# EAGLE schematic das48 (EAGLE 9.6.2)
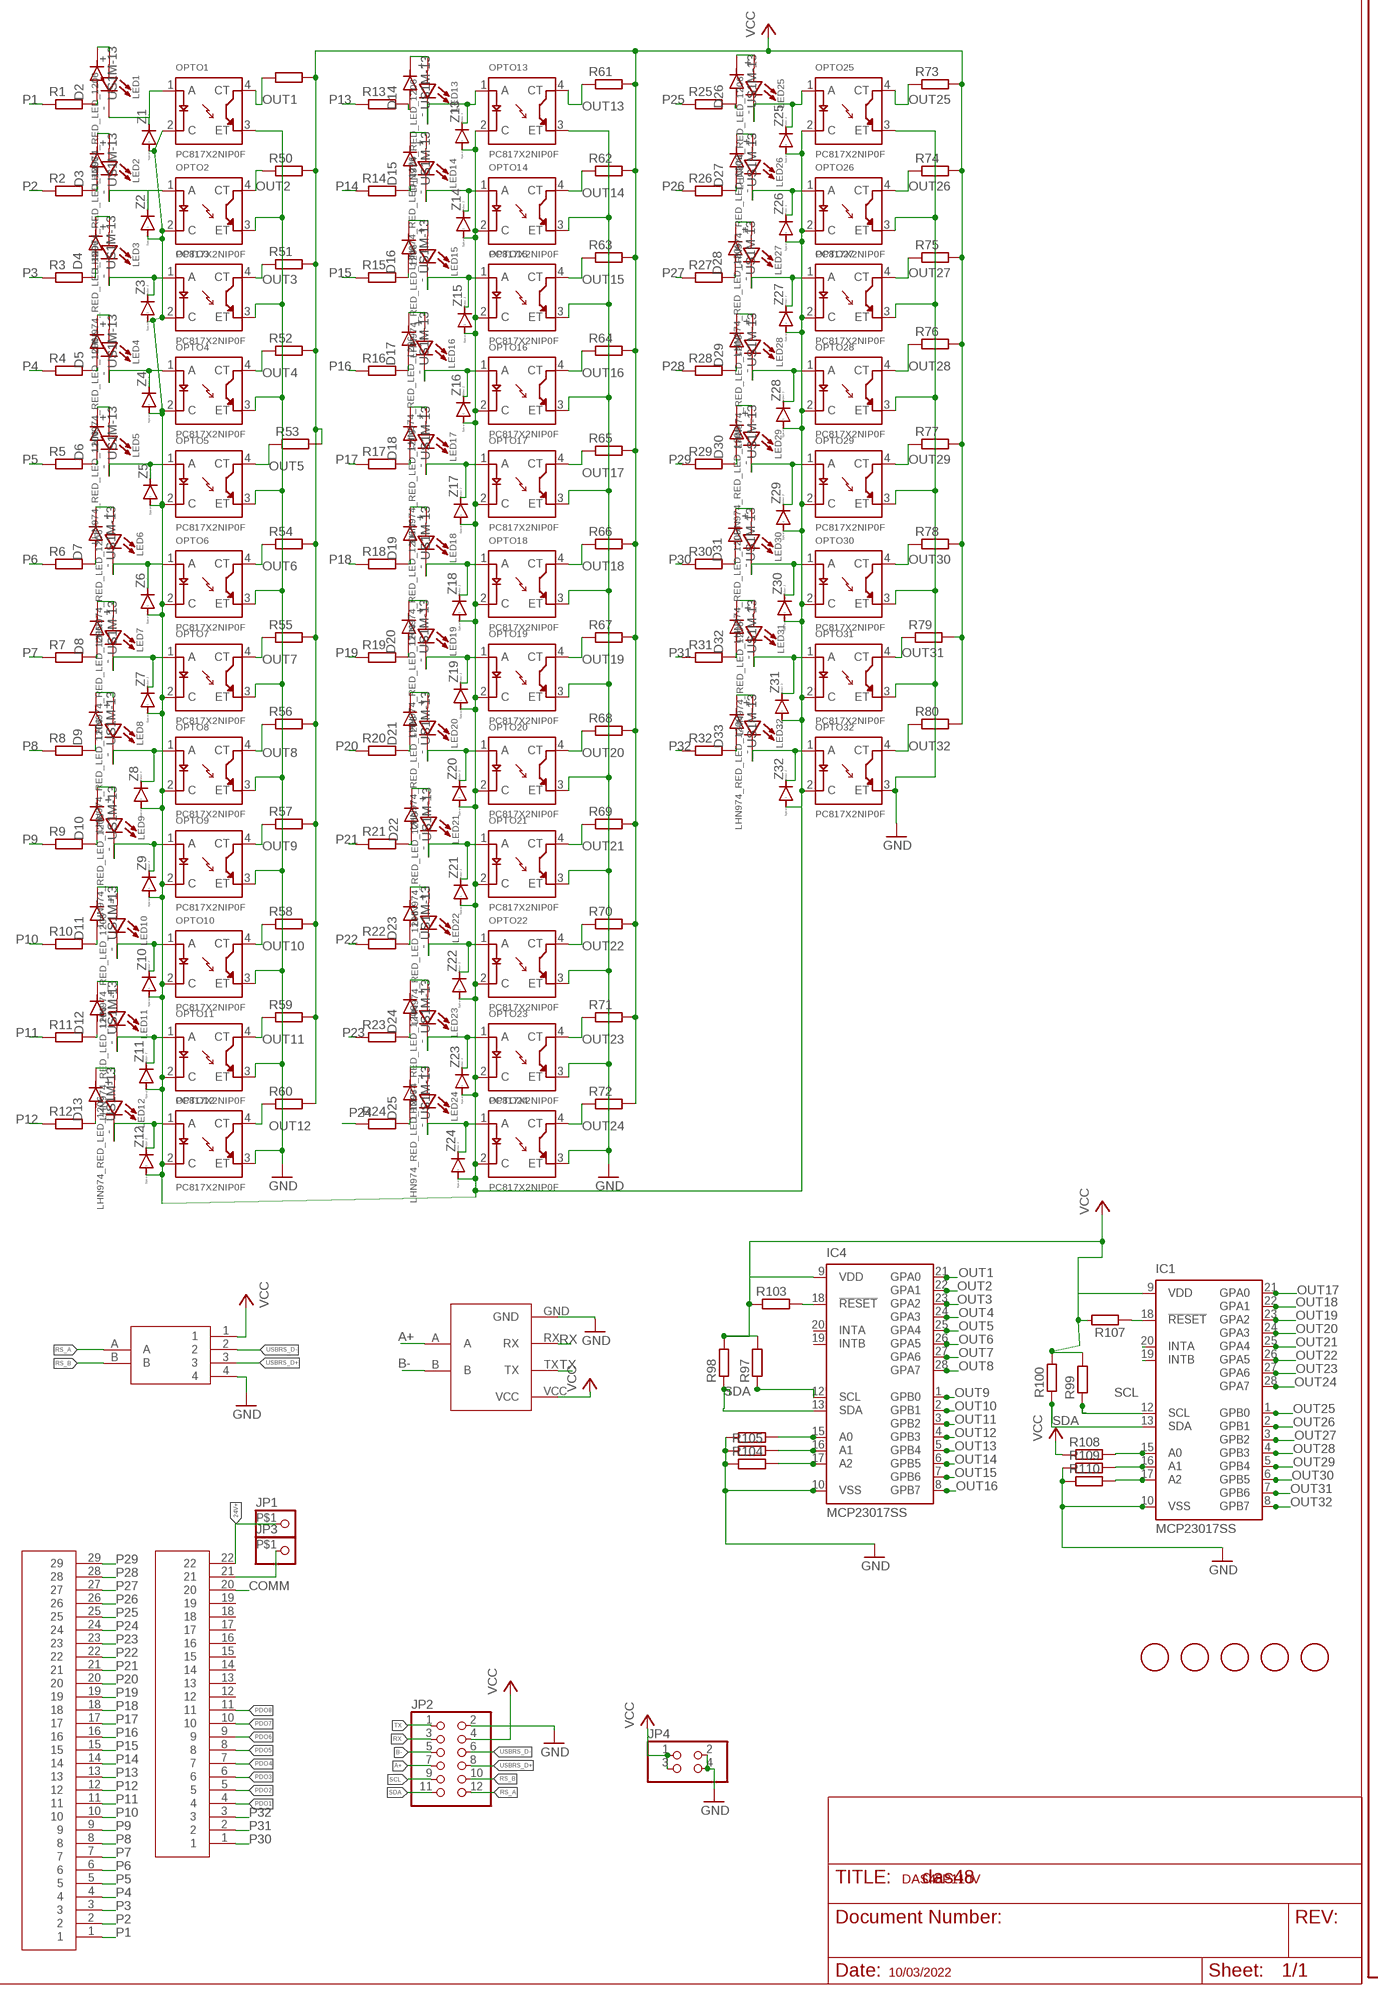
[diagram p0: schematic, sheet 1, part 1 of 2]
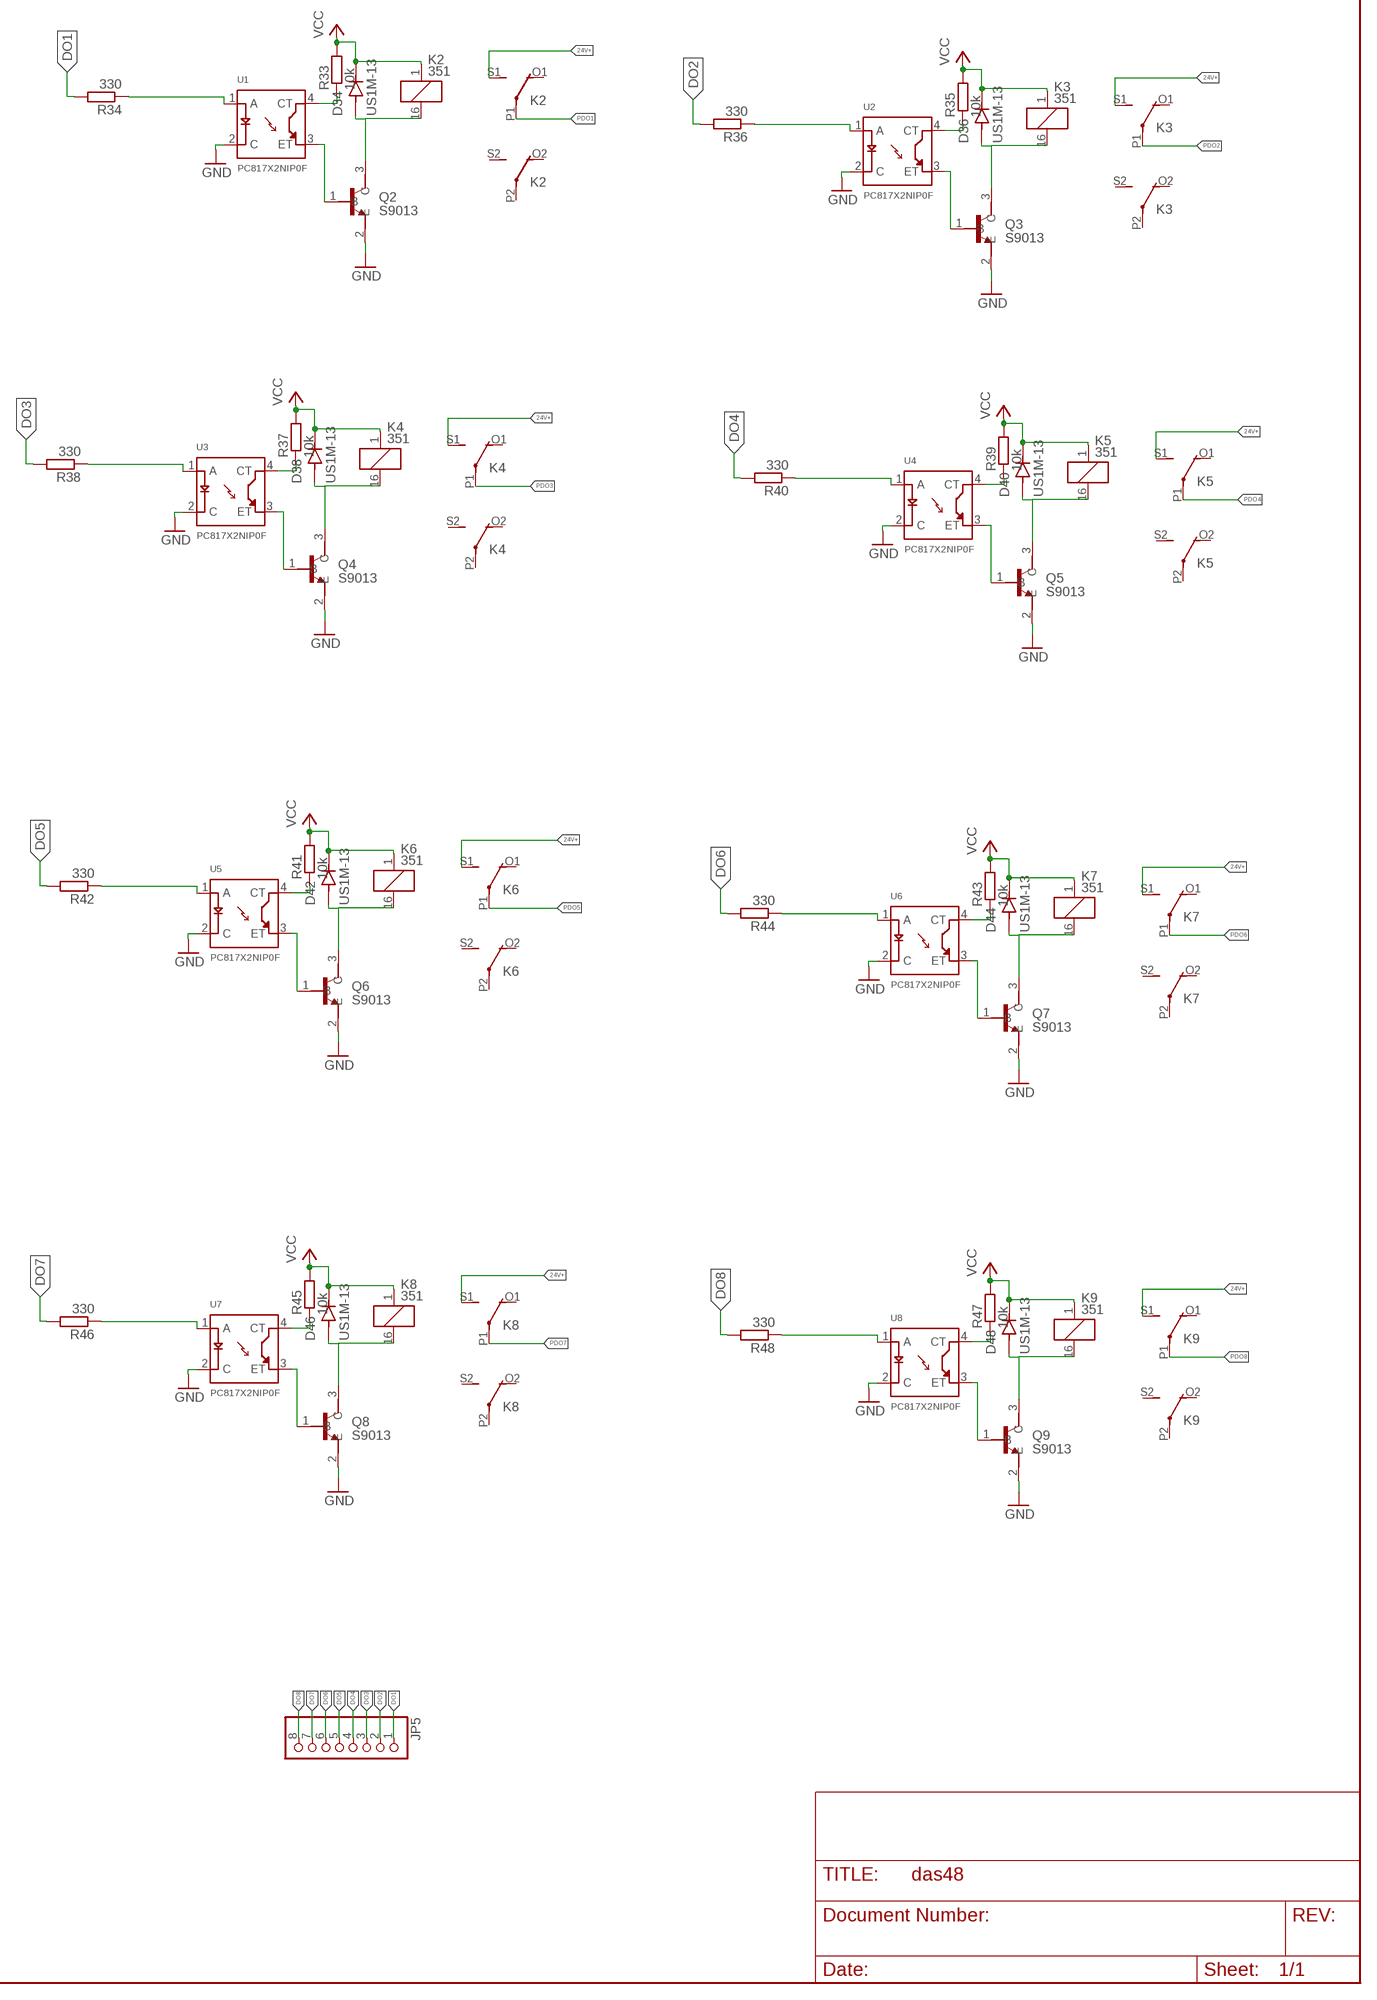
[diagram p1: schematic, sheet 1, part 2 of 2]

## Parts
D2  US1M-13  [DIOM5226X240N]
D3  US1M-13  [DIOM5226X240N]
D4  US1M-13  [DIOM5226X240N]
D5  US1M-13  [DIOM5226X240N]
D6  US1M-13  [DIOM5226X240N]
D7  US1M-13  [DIOM5226X240N]
D8  US1M-13  [DIOM5226X240N]
D9  US1M-13  [DIOM5226X240N]
D10  US1M-13  [DIOM5226X240N]
D11  US1M-13  [DIOM5226X240N]
D12  US1M-13  [DIOM5226X240N]
D13  US1M-13  [DIOM5226X240N]
D14  US1M-13  [DIOM5226X240N]
D15  US1M-13  [DIOM5226X240N]
D16  US1M-13  [DIOM5226X240N]
D17  US1M-13  [DIOM5226X240N]
D18  US1M-13  [DIOM5226X240N]
D19  US1M-13  [DIOM5226X240N]
D20  US1M-13  [DIOM5226X240N]
D21  US1M-13  [DIOM5226X240N]
D22  US1M-13  [DIOM5226X240N]
D23  US1M-13  [DIOM5226X240N]
D24  US1M-13  [DIOM5226X240N]
D25  US1M-13  [DIOM5226X240N]
D26  US1M-13  [DIOM5226X240N]
D27  US1M-13  [DIOM5226X240N]
D28  US1M-13  [DIOM5226X240N]
D29  US1M-13  [DIOM5226X240N]
D30  US1M-13  [DIOM5226X240N]
D31  US1M-13  [DIOM5226X240N]
D32  US1M-13  [DIOM5226X240N]
D33  US1M-13  [DIOM5226X240N]
D34  US1M-13  [DIOM5226X240N]
D36  US1M-13  [DIOM5226X240N]
D38  US1M-13  [DIOM5226X240N]
D40  US1M-13  [DIOM5226X240N]
D42  US1M-13  [DIOM5226X240N]
D44  US1M-13  [DIOM5226X240N]
D46  US1M-13  [DIOM5226X240N]
D48  US1M-13  [DIOM5226X240N]
HEADER-22P1  HEADER-22P  [HEADER-29P]
HEADER-29P1  HEADER-29P  [HEADER-29P]
IC1  MCP23017SS  [SSOP28DB]
IC4  MCP23017SS  [SSOP28DB]
JP1  PINHD-1X1-BIGPOGO  [1X1-BIGPOGO]
JP2  PINHD-2X6  [2X06]
JP3  PINHD-1X1-BIGPOGO  [1X1-BIGPOGO]
JP4  PINHD-2X2  [2X02]
JP5  PINHD-1X8  [1X08]
K2  351  [351]
K3  351  [351]
K4  351  [351]
K5  351  [351]
K6  351  [351]
K7  351  [351]
K8  351  [351]
K9  351  [351]
LED1  LHN974_RED_LED_1206  [LEDC3216X120N]
LED2  LHN974_RED_LED_1206  [LEDC3216X120N]
LED3  LHN974_RED_LED_1206  [LEDC3216X120N]
LED4  LHN974_RED_LED_1206  [LEDC3216X120N]
LED5  LHN974_RED_LED_1206  [LEDC3216X120N]
LED6  LHN974_RED_LED_1206  [LEDC3216X120N]
LED7  LHN974_RED_LED_1206  [LEDC3216X120N]
LED8  LHN974_RED_LED_1206  [LEDC3216X120N]
LED9  LHN974_RED_LED_1206  [LEDC3216X120N]
LED10  LHN974_RED_LED_1206  [LEDC3216X120N]
LED11  LHN974_RED_LED_1206  [LEDC3216X120N]
LED12  LHN974_RED_LED_1206  [LEDC3216X120N]
LED13  LHN974_RED_LED_1206  [LEDC3216X120N]
LED14  LHN974_RED_LED_1206  [LEDC3216X120N]
LED15  LHN974_RED_LED_1206  [LEDC3216X120N]
LED16  LHN974_RED_LED_1206  [LEDC3216X120N]
LED17  LHN974_RED_LED_1206  [LEDC3216X120N]
LED18  LHN974_RED_LED_1206  [LEDC3216X120N]
LED19  LHN974_RED_LED_1206  [LEDC3216X120N]
LED20  LHN974_RED_LED_1206  [LEDC3216X120N]
LED21  LHN974_RED_LED_1206  [LEDC3216X120N]
LED22  LHN974_RED_LED_1206  [LEDC3216X120N]
LED23  LHN974_RED_LED_1206  [LEDC3216X120N]
LED24  LHN974_RED_LED_1206  [LEDC3216X120N]
LED25  LHN974_RED_LED_1206  [LEDC3216X120N]
LED26  LHN974_RED_LED_1206  [LEDC3216X120N]
LED27  LHN974_RED_LED_1206  [LEDC3216X120N]
LED28  LHN974_RED_LED_1206  [LEDC3216X120N]
LED29  LHN974_RED_LED_1206  [LEDC3216X120N]
LED30  LHN974_RED_LED_1206  [LEDC3216X120N]
LED31  LHN974_RED_LED_1206  [LEDC3216X120N]
LED32  LHN974_RED_LED_1206  [LEDC3216X120N]
OPTO1  PC817X2NIP0F  [SOT254P975X400-4N]
OPTO2  PC817X2NIP0F  [SOT254P975X400-4N]
OPTO3  PC817X2NIP0F  [SOT254P975X400-4N]
OPTO4  PC817X2NIP0F  [SOT254P975X400-4N]
OPTO5  PC817X2NIP0F  [SOT254P975X400-4N]
OPTO6  PC817X2NIP0F  [SOT254P975X400-4N]
OPTO7  PC817X2NIP0F  [SOT254P975X400-4N]
OPTO8  PC817X2NIP0F  [SOT254P975X400-4N]
OPTO9  PC817X2NIP0F  [SOT254P975X400-4N]
OPTO10  PC817X2NIP0F  [SOT254P975X400-4N]
OPTO11  PC817X2NIP0F  [SOT254P975X400-4N]
OPTO12  PC817X2NIP0F  [SOT254P975X400-4N]
OPTO13  PC817X2NIP0F  [SOT254P975X400-4N]
OPTO14  PC817X2NIP0F  [SOT254P975X400-4N]
OPTO15  PC817X2NIP0F  [SOT254P975X400-4N]
OPTO16  PC817X2NIP0F  [SOT254P975X400-4N]
OPTO17  PC817X2NIP0F  [SOT254P975X400-4N]
OPTO18  PC817X2NIP0F  [SOT254P975X400-4N]
OPTO19  PC817X2NIP0F  [SOT254P975X400-4N]
OPTO20  PC817X2NIP0F  [SOT254P975X400-4N]
OPTO21  PC817X2NIP0F  [SOT254P975X400-4N]
OPTO22  PC817X2NIP0F  [SOT254P975X400-4N]
OPTO23  PC817X2NIP0F  [SOT254P975X400-4N]
OPTO24  PC817X2NIP0F  [SOT254P975X400-4N]
OPTO25  PC817X2NIP0F  [SOT254P975X400-4N]
OPTO26  PC817X2NIP0F  [SOT254P975X400-4N]
OPTO27  PC817X2NIP0F  [SOT254P975X400-4N]
OPTO28  PC817X2NIP0F  [SOT254P975X400-4N]
OPTO29  PC817X2NIP0F  [SOT254P975X400-4N]
OPTO30  PC817X2NIP0F  [SOT254P975X400-4N]
OPTO31  PC817X2NIP0F  [SOT254P975X400-4N]
OPTO32  PC817X2NIP0F  [SOT254P975X400-4N]
Q2  S9013  [SOT95P240X120-3N]
Q3  S9013  [SOT95P240X120-3N]
Q4  S9013  [SOT95P240X120-3N]
Q5  S9013  [SOT95P240X120-3N]
Q6  S9013  [SOT95P240X120-3N]
Q7  S9013  [SOT95P240X120-3N]
Q8  S9013  [SOT95P240X120-3N]
Q9  S9013  [SOT95P240X120-3N]
R1  R-EU_0617/17  [0617/17]
R2  R-EU_0617/17  [0617/17]
R3  R-EU_0617/17  [0617/17]
R4  R-EU_0617/17  [0617/17]
R5  R-EU_0617/17  [0617/17]
R6  R-EU_0617/17  [0617/17]
R7  R-EU_0617/17  [0617/17]
R8  R-EU_0617/17  [0617/17]
R9  R-EU_0617/17  [0617/17]
R10  R-EU_0617/17  [0617/17]
R11  R-EU_0617/17  [0617/17]
R12  R-EU_0617/17  [0617/17]
R13  R-EU_0617/17  [0617/17]
R14  R-EU_0617/17  [0617/17]
R15  R-EU_0617/17  [0617/17]
R16  R-EU_0617/17  [0617/17]
R17  R-EU_0617/17  [0617/17]
R18  R-EU_0617/17  [0617/17]
R19  R-EU_0617/17  [0617/17]
R20  R-EU_0617/17  [0617/17]
R21  R-EU_0617/17  [0617/17]
R22  R-EU_0617/17  [0617/17]
R23  R-EU_0617/17  [0617/17]
R24  R-EU_0617/17  [0617/17]
R25  R-EU_0617/17  [0617/17]
R26  R-EU_0617/17  [0617/17]
R27  R-EU_0617/17  [0617/17]
R28  R-EU_0617/17  [0617/17]
R29  R-EU_0617/17  [0617/17]
R30  R-EU_0617/17  [0617/17]
R31  R-EU_0617/17  [0617/17]
R32  R-EU_0617/17  [0617/17]
R33  10k  R-EU_R0805  [R0805]
R34  330  R-EU_R0805  [R0805]
R35  10k  R-EU_R0805  [R0805]
R36  330  R-EU_R0805  [R0805]
R37  10k  R-EU_R0805  [R0805]
R38  330  R-EU_R0805  [R0805]
R39  10k  R-EU_R0805  [R0805]
R40  330  R-EU_R0805  [R0805]
R41  10k  R-EU_R0805  [R0805]
R42  330  R-EU_R0805  [R0805]
R43  10k  R-EU_R0805  [R0805]
R44  330  R-EU_R0805  [R0805]
R45  10k  R-EU_R0805  [R0805]
R46  330  R-EU_R0805  [R0805]
R47  10k  R-EU_R0805  [R0805]
R48  330  R-EU_R0805  [R0805]
R49  R-EU_R0805  [R0805]
R50  R-EU_R0805  [R0805]
R51  R-EU_R0805  [R0805]
R52  R-EU_R0805  [R0805]
R53  R-EU_R0805  [R0805]
R54  R-EU_R0805  [R0805]
R55  R-EU_R0805  [R0805]
R56  R-EU_R0805  [R0805]
R57  R-EU_R0805  [R0805]
R58  R-EU_R0805  [R0805]
R59  R-EU_R0805  [R0805]
R60  R-EU_R0805  [R0805]
R61  R-EU_R0805  [R0805]
R62  R-EU_R0805  [R0805]
R63  R-EU_R0805  [R0805]
R64  R-EU_R0805  [R0805]
R65  R-EU_R0805  [R0805]
R66  R-EU_R0805  [R0805]
R67  R-EU_R0805  [R0805]
R68  R-EU_R0805  [R0805]
R69  R-EU_R0805  [R0805]
R70  R-EU_R0805  [R0805]
R71  R-EU_R0805  [R0805]
R72  R-EU_R0805  [R0805]
R73  R-EU_R0805  [R0805]
R74  R-EU_R0805  [R0805]
R75  R-EU_R0805  [R0805]
R76  R-EU_R0805  [R0805]
R77  R-EU_R0805  [R0805]
R78  R-EU_R0805  [R0805]
R79  R-EU_R0805  [R0805]
R80  R-EU_R0805  [R0805]
R97  R-EU_R0805  [R0805]
R98  R-EU_R0805  [R0805]
R99  R-EU_R0805  [R0805]
R100  R-EU_R0805  [R0805]
R103  R-EU_R0805  [R0805]
R104  R-EU_R0805  [R0805]
R105  R-EU_R0805  [R0805]
R106  R-EU_R0805  [R0805]
R107  R-EU_R0805  [R0805]
R108  R-EU_R0805  [R0805]
R109  R-EU_R0805  [R0805]
R110  R-EU_R0805  [R0805]
TTL-RS1  TTL-RS485  [TTL-RS485]
U1  PC817X2NIP0F  [SOT254P975X400-4N]
U2  PC817X2NIP0F  [SOT254P975X400-4N]
U3  PC817X2NIP0F  [SOT254P975X400-4N]
U4  PC817X2NIP0F  [SOT254P975X400-4N]
U5  PC817X2NIP0F  [SOT254P975X400-4N]
U6  PC817X2NIP0F  [SOT254P975X400-4N]
U7  PC817X2NIP0F  [SOT254P975X400-4N]
U8  PC817X2NIP0F  [SOT254P975X400-4N]
U$1  FIDUCIAL  [FIDUCIAL_1MM]
U$2  FIDUCIAL  [FIDUCIAL_1MM]
U$3  FIDUCIAL  [FIDUCIAL_1MM]
U$4  FIDUCIAL  [FIDUCIAL_1MM]
U$5  FIDUCIAL  [FIDUCIAL_1MM]
USB2RS1  USB2RS485  [USB2RS485]
Z1  DIODE-SOD123  [SOD123]
Z2  DIODE-SOD123  [SOD123]
Z3  DIODE-SOD123  [SOD123]
Z4  DIODE-SOD123  [SOD123]
Z5  DIODE-SOD123  [SOD123]
Z6  DIODE-SOD123  [SOD123]
Z7  DIODE-SOD123  [SOD123]
Z8  DIODE-SOD123  [SOD123]
Z9  DIODE-SOD123  [SOD123]
Z10  DIODE-SOD123  [SOD123]
Z11  DIODE-SOD123  [SOD123]
Z12  DIODE-SOD123  [SOD123]
Z13  DIODE-SOD123  [SOD123]
Z14  DIODE-SOD123  [SOD123]
Z15  DIODE-SOD123  [SOD123]
Z16  DIODE-SOD123  [SOD123]
Z17  DIODE-SOD123  [SOD123]
Z18  DIODE-SOD123  [SOD123]
Z19  DIODE-SOD123  [SOD123]
Z20  DIODE-SOD123  [SOD123]
Z21  DIODE-SOD123  [SOD123]
Z22  DIODE-SOD123  [SOD123]
Z23  DIODE-SOD123  [SOD123]
Z24  DIODE-SOD123  [SOD123]
Z25  DIODE-SOD123  [SOD123]
Z26  DIODE-SOD123  [SOD123]
Z27  DIODE-SOD123  [SOD123]
Z28  DIODE-SOD123  [SOD123]
Z29  DIODE-SOD123  [SOD123]
Z30  DIODE-SOD123  [SOD123]
Z31  DIODE-SOD123  [SOD123]
Z32  DIODE-SOD123  [SOD123]

## Nets
24V+: HEADER-22P1.22 JP1.P$1 K2.S1(2:S) K3.S1(2:S) K4.S1(2:S) K5.S1(2:S) K6.S1(2:S) K7.S1(2:S) K8.S1(2:S) K9.S1(2:S)
A+: JP2.7 TTL-RS1.A
B-: JP2.5 TTL-RS1.B
COMM: HEADER-22P1.20 OPTO1.2(C) OPTO2.2(C) OPTO3.2(C) OPTO4.2(C) OPTO5.2(C) OPTO6.2(C) OPTO7.2(C) OPTO8.2(C) OPTO9.2(C) OPTO10.2(C) OPTO11.2(C) OPTO12.2(C) OPTO13.2(C) OPTO14.2(C) OPTO15.2(C) OPTO16.2(C) OPTO17.2(C) OPTO18.2(C) OPTO19.2(C) OPTO20.2(C) OPTO21.2(C) OPTO22.2(C) OPTO23.2(C) OPTO24.2(C) OPTO25.2(C) OPTO26.2(C) OPTO27.2(C) OPTO28.2(C) OPTO29.2(C) OPTO30.2(C) OPTO31.2(C) OPTO32.2(C) Z1.A Z2.A Z3.A Z4.A Z5.A Z6.A Z7.A Z8.A Z9.A Z10.A Z11.A Z12.A Z13.A Z14.A Z15.A Z16.A Z17.A Z18.A Z19.A Z20.A Z21.A Z22.A Z23.A Z24.A Z25.A Z26.A Z27.A Z28.A Z29.A Z30.A Z31.A Z32.A
DO1: JP5.1 R34.2
DO2: JP5.2 R36.2
DO3: JP5.3 R38.2
DO4: JP5.4 R40.2
DO5: JP5.5 R42.2
DO6: JP5.6 R44.2
DO7: JP5.7 R46.2
DO8: JP5.8 R48.2
GND: IC1.10(VSS) IC4.10(VSS) JP2.2 JP4.2 JP4.4 OPTO1.3(ET) OPTO2.3(ET) OPTO3.3(ET) OPTO4.3(ET) OPTO5.3(ET) OPTO6.3(ET) OPTO7.3(ET) OPTO8.3(ET) OPTO9.3(ET) OPTO10.3(ET) OPTO11.3(ET) OPTO12.3(ET) OPTO13.3(ET) OPTO14.3(ET) OPTO15.3(ET) OPTO16.3(ET) OPTO17.3(ET) OPTO18.3(ET) OPTO19.3(ET) OPTO20.3(ET) OPTO21.3(ET) OPTO22.3(ET) OPTO23.3(ET) OPTO24.3(ET) OPTO25.3(ET) OPTO26.3(ET) OPTO27.3(ET) OPTO28.3(ET) OPTO29.3(ET) OPTO30.3(ET) OPTO31.3(ET) OPTO32.3(ET) Q2.2(E) Q3.2(E) Q4.2(E) Q5.2(E) Q6.2(E) Q7.2(E) Q8.2(E) Q9.2(E) R104.1 R105.1 R106.1 R109.1 R110.1 TTL-RS1.GND U1.2(C) U2.2(C) U3.2(C) U4.2(C) U5.2(C) U6.2(C) U7.2(C) U8.2(C) USB2RS1.4
N$1: D2.A R1.2
N$2: D2.C(K) LED1.+
N$3: D3.A R2.2
N$4: D3.C(K) LED2.+
N$5: D4.A R3.2
N$6: D4.C(K) LED3.+
N$7: D5.A R4.2
N$8: D5.C(K) LED4.+
N$9: D6.A R5.2
N$10: D6.C(K) LED5.+
N$11: D7.A R6.2
N$12: D7.C(K) LED6.+
N$13: D8.A R7.2
N$14: D8.C(K) LED7.+
N$15: D9.A R8.2
N$16: D9.C(K) LED8.+
N$17: D15.A R14.2
N$18: LED1.- OPTO1.1(A) Z1.C
N$19: LED13.- OPTO13.1(A) Z13.C
N$20: D10.A R9.2
N$21: LED14.- OPTO14.1(A) Z14.C
N$22: D10.C(K) LED9.+
N$23: LED15.- OPTO15.1(A) Z15.C
N$24: D11.A R10.2
N$25: LED16.- OPTO16.1(A) Z16.C
N$26: D11.C(K) LED10.+
N$27: LED17.- OPTO17.1(A) Z17.C
N$28: D12.A R11.2
N$29: LED18.- OPTO18.1(A) Z18.C
N$30: D12.C(K) LED11.+
N$31: LED19.- OPTO19.1(A) Z19.C
N$32: LED20.- OPTO20.1(A) Z20.C
N$33: LED21.- OPTO21.1(A) Z21.C
N$34: D15.C(K) LED14.+
N$35: LED22.- OPTO22.1(A) Z22.C
N$36: D13.A R12.2
N$37: LED23.- OPTO23.1(A) Z23.C
N$38: D13.C(K) LED12.+
N$39: LED24.- OPTO24.1(A) Z24.C
N$40: D14.A R13.2
N$41: LED25.- OPTO25.1(A) Z25.C
N$42: D14.C(K) LED13.+
N$43: LED26.- OPTO26.1(A) Z26.C
N$44: D16.A R15.2
N$45: LED27.- OPTO27.1(A) Z27.C
N$46: D16.C(K) LED15.+
N$47: LED28.- OPTO28.1(A) Z28.C
N$48: D17.A R16.2
N$49: LED29.- OPTO29.1(A) Z29.C
N$50: D17.C(K) LED16.+
N$51: LED30.- OPTO30.1(A) Z30.C
N$52: D18.A R17.2
N$53: LED31.- OPTO31.1(A) Z31.C
N$54: D18.C(K) LED17.+
N$55: LED32.- OPTO32.1(A) Z32.C
N$56: D19.A R18.2
N$57: R34.1 U1.1(A)
N$58: D19.C(K) LED18.+
N$59: D34.A K2.16 Q2.3(C)
N$60: D20.A R19.2
N$61: R36.1 U2.1(A)
N$62: D20.C(K) LED19.+
N$63: R33.1 U1.4(CT)
N$64: D32.A R31.2
N$65: Q2.1(B) U1.3(ET)
N$66: D21.A R20.2
N$67: R38.1 U3.1(A)
N$68: D21.C(K) LED20.+
N$69: D36.A K3.16 Q3.3(C)
N$70: R40.1 U4.1(A)
N$71: D22.A R21.2
N$72: R35.1 U2.4(CT)
N$73: D22.C(K) LED21.+
N$74: Q3.1(B) U2.3(ET)
N$75: R42.1 U5.1(A)
N$76: D23.A R22.2
N$77: D38.A K4.16 Q4.3(C)
N$78: D23.C(K) LED22.+
N$79: R44.1 U6.1(A)
N$80: D24.A R23.2
N$81: R37.1 U3.4(CT)
N$82: D24.C(K) LED23.+
N$83: Q4.1(B) U3.3(ET)
N$84: D25.A R24.2
N$85: R46.1 U7.1(A)
N$86: LED2.- OPTO2.1(A) Z2.C
N$87: LED3.- OPTO3.1(A) Z3.C
N$88: LED4.- OPTO4.1(A) Z4.C
N$89: LED5.- OPTO5.1(A) Z5.C
N$90: LED6.- OPTO6.1(A) Z6.C
N$91: LED7.- OPTO7.1(A) Z7.C
N$92: LED8.- OPTO8.1(A) Z8.C
N$93: LED9.- OPTO9.1(A) Z9.C
N$94: LED10.- OPTO10.1(A) Z10.C
N$95: LED11.- OPTO11.1(A) Z11.C
N$96: LED12.- OPTO12.1(A) Z12.C
N$100: D40.A K5.16 Q5.3(C)
N$103: R48.1 U8.1(A)
N$104: D25.C(K) LED24.+
N$105: D26.A R25.2
N$106: D26.C(K) LED25.+
N$107: IC1.15(A0) R108.2
N$108: IC1.16(A1) R109.2
N$109: IC4.15(A0) R106.2
N$110: IC4.16(A1) R105.2
N$111: IC4.17(A2) R104.2
N$112: R39.1 U4.4(CT)
N$113: IC1.17(A2) R110.2
N$114: D27.A R26.2
N$115: D27.C(K) LED26.+
N$116: D28.A R27.2
N$117: D28.C(K) LED27.+
N$118: D32.C(K) LED31.+
N$119: D29.A R28.2
N$120: D29.C(K) LED28.+
N$121: D30.C(K) LED29.+
N$122: D30.A R29.2
N$123: D31.A R30.2
N$124: D31.C(K) LED30.+
N$125: D33.C(K) LED32.+
N$126: D33.A R32.2
N$127: Q5.1(B) U4.3(ET)
N$128: IC4.18(!RESET) R103.2
N$129: D42.A K6.16 Q6.3(C)
N$130: IC1.18(!RESET) R107.1
N$131: R41.1 U5.4(CT)
N$132: Q6.1(B) U5.3(ET)
N$134: D44.A K7.16 Q7.3(C)
N$135: IC1.20(INTA)
N$136: IC1.19(INTB)
N$138: R43.1 U6.4(CT)
N$139: Q7.1(B) U6.3(ET)
N$141: D46.A K8.16 Q8.3(C)
N$143: R45.1 U7.4(CT)
N$144: Q8.1(B) U7.3(ET)
N$146: D48.A K9.16 Q9.3(C)
N$148: R47.1 U8.4(CT)
N$149: Q9.1(B) U8.3(ET)
N$162: HEADER-22P1.21 JP3.P$1
OUT1: IC4.21(GPA0) OPTO1.4(CT) R49.1
OUT2: IC4.22(GPA1) OPTO2.4(CT) R50.1
OUT3: IC4.23(GPA2) OPTO3.4(CT) R51.1
OUT4: IC4.24(GPA3) OPTO4.4(CT) R52.1
OUT5: IC4.25(GPA4) OPTO5.4(CT) R53.1
OUT6: IC4.26(GPA5) OPTO6.4(CT) R54.1
OUT7: IC4.27(GPA6) OPTO7.4(CT) R55.1
OUT8: IC4.28(GPA7) OPTO8.4(CT) R56.1
OUT9: IC4.1(GPB0) OPTO9.4(CT) R57.1
OUT10: IC4.2(GPB1) OPTO10.4(CT) R58.1
OUT11: IC4.3(GPB2) OPTO11.4(CT) R59.1
OUT12: IC4.4(GPB3) OPTO12.4(CT) R60.1
OUT13: IC4.5(GPB4) OPTO13.4(CT) R61.1
OUT14: IC4.6(GPB5) OPTO14.4(CT) R62.1
OUT15: IC4.7(GPB6) OPTO15.4(CT) R63.1
OUT16: IC4.8(GPB7) OPTO16.4(CT) R64.1
OUT17: IC1.21(GPA0) OPTO17.4(CT) R65.1
OUT18: IC1.22(GPA1) OPTO18.4(CT) R66.1
OUT19: IC1.23(GPA2) OPTO19.4(CT) R67.1
OUT20: IC1.24(GPA3) OPTO20.4(CT) R68.1
OUT21: IC1.25(GPA4) OPTO21.4(CT) R69.1
OUT22: IC1.26(GPA5) OPTO22.4(CT) R70.1
OUT23: IC1.27(GPA6) OPTO23.4(CT) R71.1
OUT24: IC1.28(GPA7) OPTO24.4(CT) R72.1
OUT25: IC1.1(GPB0) OPTO25.4(CT) R73.1
OUT26: IC1.2(GPB1) OPTO26.4(CT) R74.1
OUT27: IC1.3(GPB2) OPTO27.4(CT) R75.1
OUT28: IC1.4(GPB3) OPTO28.4(CT) R76.1
OUT29: IC1.5(GPB4) OPTO29.4(CT) R77.1
OUT30: IC1.6(GPB5) OPTO30.4(CT) R78.1
OUT31: IC1.7(GPB6) OPTO31.4(CT) R79.1
OUT32: IC1.8(GPB7) OPTO32.4(CT) R80.1
P1: HEADER-29P1.1 R1.1
P2: HEADER-29P1.2 R2.1
P3: HEADER-29P1.3 R3.1
P4: HEADER-29P1.4 R4.1
P5: HEADER-29P1.5 R5.1
P6: HEADER-29P1.6 R6.1
P7: HEADER-29P1.7 R7.1
P8: HEADER-29P1.8 R8.1
P9: HEADER-29P1.9 R9.1
P10: HEADER-29P1.10 R10.1
P11: HEADER-29P1.11 R11.1
P12: HEADER-29P1.12 R12.1
P13: HEADER-29P1.13 R13.1
P14: HEADER-29P1.14 R14.1
P15: HEADER-29P1.15 R15.1
P16: HEADER-29P1.16 R16.1
P17: HEADER-29P1.17 R17.1
P18: HEADER-29P1.18 R18.1
P19: HEADER-29P1.19 R19.1
P20: HEADER-29P1.20 R20.1
P21: HEADER-29P1.21 R21.1
P22: HEADER-29P1.22 R22.1
P23: HEADER-29P1.23 R23.1
P24: HEADER-29P1.24 R24.1
P25: HEADER-29P1.25 R25.1
P26: HEADER-29P1.26 R26.1
P27: HEADER-29P1.27 R27.1
P28: HEADER-29P1.28 R28.1
P29: HEADER-29P1.29 R29.1
P30: HEADER-22P1.1 R30.1
P31: HEADER-22P1.2 R31.1
P32: HEADER-22P1.3 R32.1
PDO1: HEADER-22P1.4 K2.P1(2:P)
PDO2: HEADER-22P1.5 K3.P1(2:P)
PDO3: HEADER-22P1.6 K4.P1(2:P)
PDO4: HEADER-22P1.7 K5.P1(2:P)
PDO5: HEADER-22P1.8 K6.P1(2:P)
PDO6: HEADER-22P1.9 K7.P1(2:P)
PDO7: HEADER-22P1.10 K8.P1(2:P)
PDO8: HEADER-22P1.11 K9.P1(2:P)
RS_A: JP2.12 USB2RS1.A
RS_B: JP2.10 USB2RS1.B
RX: JP2.3 TTL-RS1.RX
SCL: IC1.12(SCL) IC4.12(SCL) JP2.9 R97.1 R99.1
SDA: IC1.13(SDA) IC4.13(SDA) JP2.11 R98.1 R100.1
TX: JP2.1 TTL-RS1.TX
USBRS_D+: JP2.8 USB2RS1.3
USBRS_D-: JP2.6 USB2RS1.2
VCC: D34.C(K) D36.C(K) D38.C(K) D40.C(K) D42.C(K) D44.C(K) D46.C(K) D48.C(K) IC1.9(VDD) IC4.9(VDD) JP2.4 JP4.1 JP4.3 K2.1 K3.1 K4.1 K5.1 K6.1 K7.1 K8.1 K9.1 R33.2 R35.2 R37.2 R39.2 R41.2 R43.2 R45.2 R47.2 R49.2 R50.2 R51.2 R52.2 R53.2 R54.2 R55.2 R56.2 R57.2 R58.2 R59.2 R60.2 R61.2 R62.2 R63.2 R64.2 R65.2 R66.2 R67.2 R68.2 R69.2 R70.2 R71.2 R72.2 R73.2 R74.2 R75.2 R76.2 R77.2 R78.2 R79.2 R80.2 R97.2 R98.2 R99.2 R100.2 R103.1 R107.2 R108.1 TTL-RS1.VCC USB2RS1.1
Unconnected: HEADER-22P1.12 HEADER-22P1.13 HEADER-22P1.14 HEADER-22P1.15 HEADER-22P1.16 HEADER-22P1.17 HEADER-22P1.18 HEADER-22P1.19 IC4.19(INTB) IC4.20(INTA) K2.O1(2:O) K2.O2(3:O) K2.P2(3:P) K2.S2(3:S) K3.O1(2:O) K3.O2(3:O) K3.P2(3:P) K3.S2(3:S) K4.O1(2:O) K4.O2(3:O) K4.P2(3:P) K4.S2(3:S) K5.O1(2:O) K5.O2(3:O) K5.P2(3:P) K5.S2(3:S) K6.O1(2:O) K6.O2(3:O) K6.P2(3:P) K6.S2(3:S) K7.O1(2:O) K7.O2(3:O) K7.P2(3:P) K7.S2(3:S) K8.O1(2:O) K8.O2(3:O) K8.P2(3:P) K8.S2(3:S) K9.O1(2:O) K9.O2(3:O) K9.P2(3:P) K9.S2(3:S)

## Notes on the sheet
- DAS48P110V
- 10/03/2022

## Library data of the parts
D2-D34 D36 D38 D40 D42 D44 D46 D48 = US1M-13:US1M-13: Diode, Fast Recovery, 1a, 1kv, Do-214ac-2, Full Reel Check availability <https://pricing.snapeda.com/parts/US1M-13/Diodes%20Incorporated/view-part?ref=eda>; AVAILABILITY: In Stock; DESCRIPTION: Diode Standard 1000 V 1A Surface Mount SMA; MF: Diodes Incorporated; MP: US1M-13; PACKAGE: DO-214AC-214 Diodes Incorporated; PRICE: None; PURCHASE-URL: https://pricing.snapeda.com/search/part/US1M-13/?ref=eda
HEADER-22P1 = HEADER-22P:HEADER-22P
HEADER-29P1 = HEADER-29P:HEADER-29P
IC1 IC4 = adafruit_edited:MCP23017: http://ww1.microchip.com/downloads/en/DeviceDoc/21952a.pdf Source: http://ww1.microchip.com/downloads/en/DeviceDoc/21952a.pdf
JP1 JP3 = adafruit:PINHD-1X1: Pin header 1x1 for 0.1" spacing With round pins
JP2 = pinhead:PINHD-2X6: PIN HEADER
JP4 = pinhead:PINHD-2X2: PIN HEADER
JP5 = pinhead:PINHD-1X8: PIN HEADER
K2-K9 = relay:351: RELAY 2 x switch, Omron; OC_FARNELL: unknown; OC_NEWARK: unknown
LED1-LED32 = LHN974_RED_LED_1206:LHN974_RED_LED_1206: LED Chip 1206 Check availability <https://pricing.snapeda.com/parts/LHN974%20RED%20LED%201206/Osram/view-part?ref=eda>; AVAILABILITY: Not in stock; DESCRIPTION: 2.6 V Red LED SMD; MF: Osram; MP: LHN974 RED LED 1206; PACKAGE: None; PRICE: None
OPTO1-OPTO32 U1-U8 = PC817X2NIP0F:PC817X2NIP0F: PC817 Series 1 Channel 80 V 5000 Vrms General Purpose Photocoupler - DIP-4 Check availability <https://pricing.snapeda.com/parts/PC817X2NIP0F/Sharp%20Microelectronics/view-part?ref=eda>; AVAILABILITY: Not in stock; DESCRIPTION: Optoisolator Transistor Output 5000Vrms 1 Channel 4-SMD; MF: Sharp Microelectronics; MP: PC817X2NIP0F; PACKAGE: SMD-4 Sharp Microelectronics; PRICE: None
Q2-Q9 = S9013:S9013: SMD Transistors NPN 25V-500mA Check availability <https://pricing.snapeda.com/parts/S9013/JCET/view-part?ref=eda>; AVAILABILITY: Not in stock; DESCRIPTION: Bipolar (BJT) Transistor NPN 20V 500mA 625mW Through Hole TO-92-3; MF: JCET; MP: S9013; PACKAGE: SOT-23-3 JCET; PRICE: None
R1-R80 R97-R100 R103-R110 = rcl:R-EU_: RESISTOR, European symbol; SPICEPREFIX: R
TTL-RS1 = TTL-RS485:TTL-RS485
U$1-U$5 = adafruit:FIDUCIAL: For use by pick and place machines to calibrate the vision/machine, 1mm By microbuilder.eu
USB2RS1 = USB2RS485:USB2RS485
Z1-Z32 = diode:DIODE-: DIODE

## Net classes
0 default: drill 0.6 mm, clearance 0.3 mm